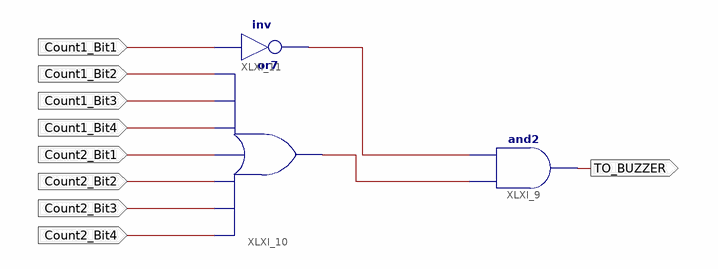
[diagram p0: schematic sheet 1]
// Xilinx ISE schematic Compare_divide2.sch (spartan6) as structural Verilog: 3 symbols, 9 ports
module Compare_divide2 (
  input  Count1_Bit1,
  input  Count1_Bit2,
  input  Count1_Bit3,
  input  Count1_Bit4,
  input  Count2_Bit1,
  input  Count2_Bit2,
  input  Count2_Bit3,
  input  Count2_Bit4,
  output TO_BUZZER
);

  wire XLXN_17, XLXN_21;

  and XLXI_9 (TO_BUZZER, XLXN_21, XLXN_17);
  or XLXI_10 (XLXN_21, Count2_Bit4, Count2_Bit3, Count2_Bit2, Count2_Bit1, Count1_Bit4, Count1_Bit3, Count1_Bit2);
  not XLXI_11 (XLXN_17, Count1_Bit1);
endmodule
